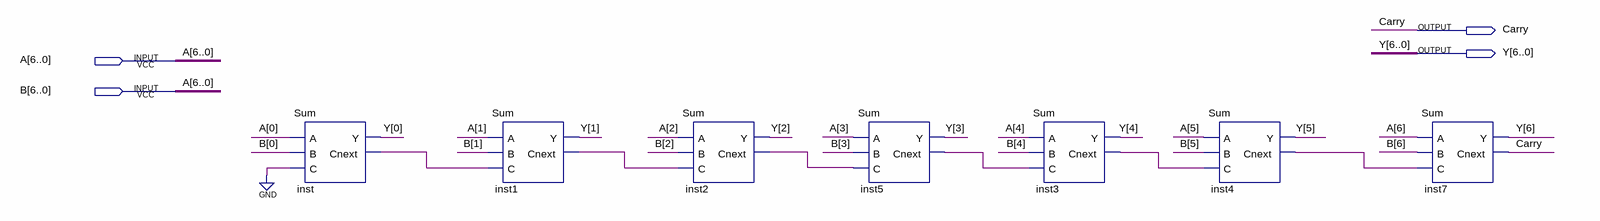
[diagram p0: schematic sheet]
// Quartus schematic Sum_6bit.bdf as structural Verilog: 7 symbols, 4 pins
module Sum_6bit (
  input  [6:0] A,
  input  [6:0] B,
  output Carry,
  output [6:0] Y
);

  wire inst1_cnext, inst2_cnext, inst3_cnext, inst4_cnext, inst5_cnext, inst_cnext;

  Sum inst (.A(A[0]), .B(A[0]), .C(1'b0), .Y(Y[0]), .Cnext(inst_cnext));
  Sum inst1 (.A(A[1]), .B(A[1]), .C(inst_cnext), .Y(Y[1]), .Cnext(inst1_cnext));
  Sum inst2 (.A(A[2]), .B(A[2]), .C(inst1_cnext), .Y(Y[2]), .Cnext(inst2_cnext));
  Sum inst5 (.A(A[3]), .B(A[3]), .C(inst2_cnext), .Y(Y[3]), .Cnext(inst5_cnext));
  Sum inst3 (.A(A[4]), .B(A[4]), .C(inst5_cnext), .Y(Y[4]), .Cnext(inst3_cnext));
  Sum inst4 (.A(A[5]), .B(A[5]), .C(inst3_cnext), .Y(Y[5]), .Cnext(inst4_cnext));
  Sum inst7 (.A(A[6]), .B(A[6]), .C(inst4_cnext), .Y(Y[6]), .Cnext(Carry));

  assign B = A;
endmodule
